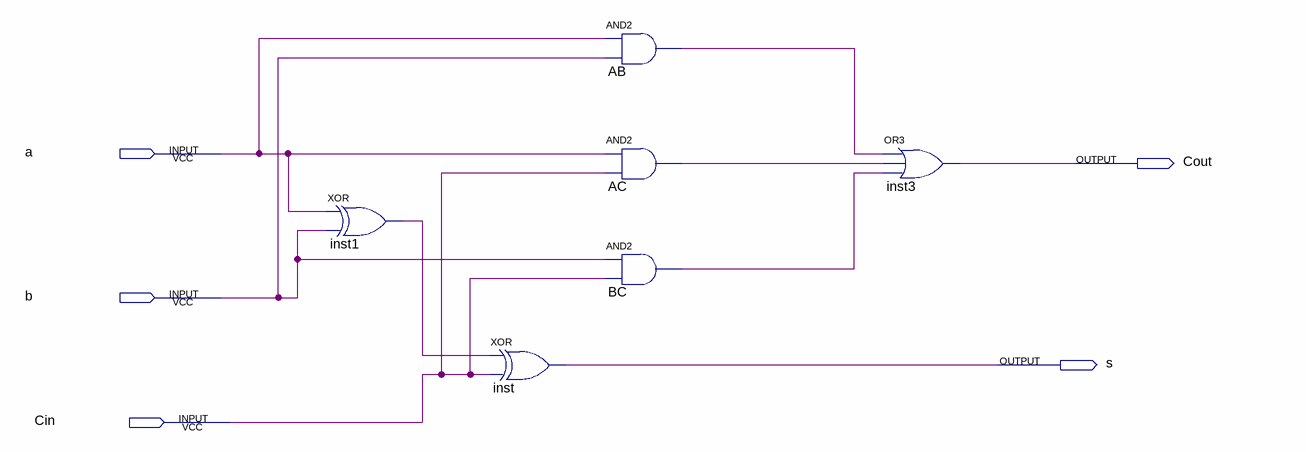
[diagram p0: schematic sheet]
// Quartus schematic lab3.bdf as structural Verilog: 6 symbols, 5 pins
module lab3 (
  input  a,
  input  b,
  input  Cin,
  output Cout,
  output s
);

  wire AB_out, AC_out, BC_out, inst1_out;

  xor inst1 (inst1_out, a, b);
  xor inst (s, inst1_out, Cin);
  and AB (AB_out, a, b);
  and AC (AC_out, a, Cin);
  and BC (BC_out, b, Cin);
  or inst3 (Cout, AB_out, AC_out, BC_out);
endmodule
